# Altium schematic sheet 12V_Supply.SchDoc
size Tabloid; Organization: Altium Limited; Address1: L3, 12a Rodborough Rd; Address2: Frenchs Forest; Address3: NSW; Address4: Australia 2086
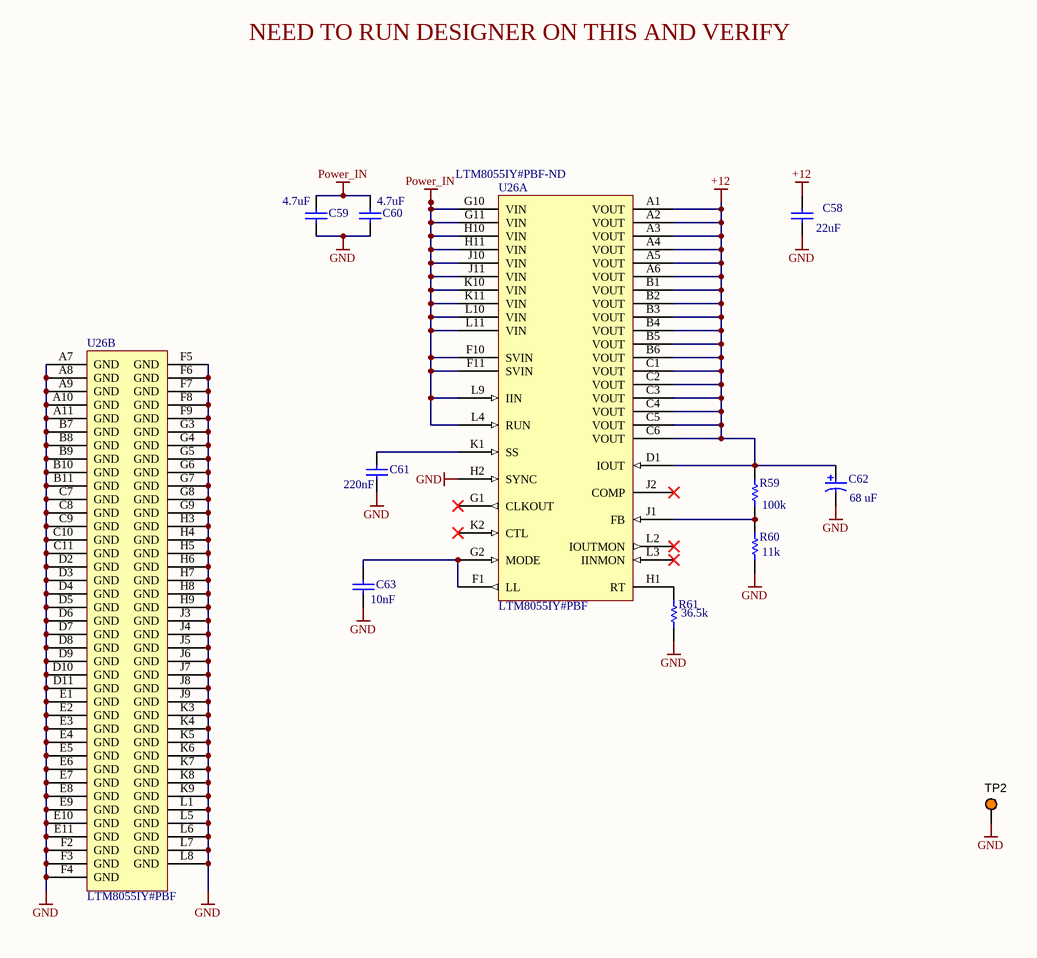
[diagram p0: 12V_Supply.SchDoc]

## Parts
C58  Capacitance: 22uF  [CAPC0805(2012)155_L]  (hidden comment: CAP CER 1UF 25V X7R 0805)
C59  Capacitance: 4.7uF  [CAPC3225X280X50LL20T25]  (hidden comment: C1210C475K5RACTU)
C60  Capacitance: 4.7uF  [CAPC3225X280X50LL20T25]  (hidden comment: C1210C475K5RACTU)
C61  Capacitance: 220nF  [CAPC0402(1005)60_M]  (hidden comment: GRM155R71C224KA12D)
C62  Rated Capacitance: 68 uF  [NIC-CAPA2-6.3X5.8_V]  (hidden comment: UUD1E680MCL1GS)
C63  Capacitance: 10nF  [CAPC1005X56X25NL10T15]  (hidden comment: 0402YC103KAT2A)
R59  Resistance: 100k  [RESC1609X50X30LL10T20]  (hidden comment: CRCW0603100KFKEA)
R60  Resistance: 11k  [RESC1609X50X30ML10T20]  (hidden comment: CRCW060311K0FKEA)
R61  Resistance: 36.5k  [RESC0805(2012)_L]  (hidden comment: CRCW080536K5FKEA)
TP2  5003  [KSTN-5003]  (value not drawn)
U26  LTM8055IY#PBF  Supplier Part Number 1: LTM8055IY#PBF-ND  [LT-BGA-121-15000X15000X4920]  (parts A,B of 2)

## Nets
+12: C58.2 C62.1 R59.2 U26.A1(VOUT) U26.A2(VOUT) U26.A3(VOUT) U26.A4(VOUT) U26.A5(VOUT) U26.A6(VOUT) U26.B1(VOUT) U26.B2(VOUT) U26.B3(VOUT) U26.B4(VOUT) U26.B5(VOUT) U26.B6(VOUT) U26.C1(VOUT) U26.C2(VOUT) U26.C3(VOUT) U26.C4(VOUT) U26.C5(VOUT) U26.C6(VOUT) U26.D1(IOUT)
GND: C58.1 C59.1 C60.1 C61.1 C62.2 C63.1 R60.1 R61.1 TP2.1 U26.A7(GND) U26.A8(GND) U26.A9(GND) U26.A10(GND) U26.A11(GND) U26.B7(GND) U26.B8(GND) U26.B9(GND) U26.B10(GND) U26.B11(GND) U26.C7(GND) U26.C8(GND) U26.C9(GND) U26.C10(GND) U26.C11(GND) U26.D2(GND) U26.D3(GND) U26.D4(GND) U26.D5(GND) U26.D6(GND) U26.D7(GND) U26.D8(GND) U26.D9(GND) U26.D10(GND) U26.D11(GND) U26.E1(GND) U26.E2(GND) U26.E3(GND) U26.E4(GND) U26.E5(GND) U26.E6(GND) U26.E7(GND) U26.E8(GND) U26.E9(GND) U26.E10(GND) U26.E11(GND) U26.F2(GND) U26.F3(GND) U26.F4(GND) U26.F5(GND) U26.F6(GND) U26.F7(GND) U26.F8(GND) U26.F9(GND) U26.G3(GND) U26.G4(GND) U26.G5(GND) U26.G6(GND) U26.G7(GND) U26.G8(GND) U26.G9(GND) U26.H2(SYNC) U26.H3(GND) U26.H4(GND) U26.H5(GND) U26.H6(GND) U26.H7(GND) U26.H8(GND) U26.H9(GND) U26.J3(GND) U26.J4(GND) U26.J5(GND) U26.J6(GND) U26.J7(GND) U26.J8(GND) U26.J9(GND) U26.K3(GND) U26.K4(GND) U26.K5(GND) U26.K6(GND) U26.K7(GND) U26.K8(GND) U26.K9(GND) U26.L1(GND) U26.L5(GND) U26.L6(GND) U26.L7(GND) U26.L8(GND)
Power_IN: C59.2 C60.2 U26.F10(SVIN) U26.F11(SVIN) U26.G10(VIN) U26.G11(VIN) U26.H10(VIN) U26.H11(VIN) U26.J10(VIN) U26.J11(VIN) U26.K10(VIN) U26.K11(VIN) U26.L4(RUN) U26.L9(IIN) U26.L10(VIN) U26.L11(VIN)
NetC61_2: C61.2 U26.K1(SS)
NetC63_2: C63.2 U26.F1(LL) U26.G2(MODE)
NetR59_1: R59.1 R60.2 U26.J1(FB)
NetR61_2: R61.2 U26.H1(RT)

Not connected (* = marked no-connect by the designer): U26 G1(CLKOUT)* J2(COMP)* K2(CTL)* L2(IOUTMON)* L3(IINMON)*

## Notes on the sheet
- NEED TO RUN DESIGNER ON THIS AND VERIFY
- Title
- Size:
- Date:
- Tabloid
- Number:
- Time:
- Revision:
- Sheet
- of
- File:

## Library data of the parts
C58 = CMP-1036-04882-1: 22uF 25V X7R 20% 0805; Manufacturer: Kyocera AVX; Manufacturer Part Number: 08053C105JAT2A; Tolerance: 5%; Supplier 1: Digi-Key; Supplier Part Number 1: 478-10487-1-ND; Stock 1: 13733; Pricing 1: 1=0.44000, 10=0.30400, 100=0.18220, 500=0.13662, 1000=0.11537 (USD); RoHS: Yes; Mount: Surface Mount; Case/Package: 0805; Number of Pins: 2; Case Code (Metric): 2012; Case Code (Imperial): 0805; Contact Plating: Tin; Min Operating Temperature: -55°C; Max Operating Temperature: 125°C; Packaging: Tape and Reel; Voltage Rating: 25V; Package Quantity: 2000; Dielectric: X7R; Voltage Rating (DC): 25V; Termination: SMD/SMT; Length: 2.01mm; Height: 1.4mm; Width: 0.049inch; Thickness: 0.037inch; Depth: 1.25mm; Radiation Hardening: No; REACH SVHC: Unknown; Lead Free: Lead Free; ComponentLink1URL: https://datasheet.ciiva.com/221/cx7r-221690.pdf?src-supplier=Digi-Key; ComponentLink1Description: https://datasheet.ciiva.com/221/cx7r-221690.pdf?src-supplier=Digi-Key; ComponentLink2URL: https://datasheet.ciiva.com/5419/cx7r-218113-5419770.pdf?src-supplier=Mouser; ComponentLink2Description: https://datasheet.ciiva.com/5419/cx7r-218113-5419770.pdf?src-supplier=Mouser; ComponentLink3URL: https://datasheet.ciiva.com/28586/1679506-28586091.pdf?src-supplier=Element14; ComponentLink3Description: https://datasheet.ciiva.com/28586/1679506-28586091.pdf?src-supplier=Element14; ComponentLink4URL: https://datasheet.ciiva.com/11499/cx7r-11499836.pdf?src-supplier=Avnet; ComponentLink4Description: https://datasheet.ciiva.com/11499/cx7r-11499836.pdf?src-supplier=Avnet
C59 C60 = CMP-2000-07550-1: Chip Capacitor, 4.7 uF, +/- 10%, 50 V, -55 to 125 degC, 1210 (3225 Metric), RoHS, Tape and Reel; Manufacturer: Kemet; Voltage Rating (DC): 50V; Dielectric Material: Ceramic; Dielectric: X7R; Case\/Package: 1210; Height: 0.098inch; Datasheet URL: https://search.kemet.com/component-edge/download/datasheet/C1210C475K5RACTU.pdf; Voltage: 50V; Packaging: TapeandReel; Package Reference: 1210; Mounting Technology: SurfaceMount; Package Description: 2-Pin Surface Mount Device, Body 3.2 x 2.5 mm; Manufacturer URL: http://www.kemet.com/; Width: 0.098inch; Voltage Rating: 50V; Package Quantity: 1000; Thickness: 0.11inch; Number of Pins: 2; Case Code (Imperial): 1210; Termination: SMD/SMT; Radiation Hardening: No; Depth: 2.5mm; RoHSCompliant: True; Datasheet Version: 06/2017; Length: 3.2mm; REACH SVHC: NoSVHC; Max Operating Temperature: 125degC; Min Operating Temperature: -55degC; Case Code (Metric): 3225; Mount: SurfaceMount; Tolerance: 10%; Supplier 1: Digi-Key; Supplier Part Number 1: 399-6785-1-ND
C61 = CMP-1034-02089-1: 0.22µF ±10% 16V Ceramic Capacitor X7R 0402 (1005 Metric); Manufacturer: Murata; Value: 220nF; Case-Metric: 1005; Case-EIA: 0402; Tolerance: Â±10%; Technology: SMT; Max Thickness: 0.6 mm; Rated Voltage: 16 V; Supplier 1: Digi-Key; Supplier Part Number 1: 490-5418-1-ND; Manufacturer Part Number: GRM155R71C224KA12D; Stock 1: 353724; Pricing 1: 1=0.14000, 10=0.10100, 100=0.04750, 500=0.03334, 1000=0.02760, 2500=0.02568, 5000=0.02350 (USD); RoHS: Yes; Mount: Surface Mount; Case/Package: 0402; Case Code (Metric): 1005; Case Code (Imperial): 0402; Material: Ceramic; Min Operating Temperature: -55°C; Max Operating Temperature: 125°C; Voltage Rating: 16V; Packaging: Tape and Reel; Package Quantity: 1; Voltage Rating (DC): 16V; Dielectric: X7R; Termination: SMD/SMT; Voltage: 16V; Length: 1mm; Height: 0.5mm; Width: 0.02inch; Thickness: 0.022inch; Depth: 0.5mm; Radiation Hardening: No; Lead Free: Lead Free; REACH SVHC: No SVHC; ComponentLink1URL: https://datasheet.ciiva.com/18184/getdatasheetpartid-347270-18184668.pdf?src-supplier=Verical; ComponentLink1Description: https://datasheet.ciiva.com/18184/getdatasheetpartid-347270-18184668.pdf?src-supplier=Verical; ComponentLink2URL: https://datasheet.ciiva.com/132/product-132672.pdf?src-supplier=Digi-Key; ComponentLink2Description: https://datasheet.ciiva.com/132/product-132672.pdf?src-supplier=Digi-Key; ComponentLink3URL: https://datasheet.ciiva.com/29199/454127-da-01-en-vs-kondensator-0402-29199807.pdf?src-supplier=Conrad; ComponentLink3Description: https://datasheet.ciiva.com/29199/454127-da-01-en-vs-kondensator-0402-29199807.pdf?src-supplier=Conrad; ComponentLink4URL: https://datasheet.ciiva.com/16467/product-16467307.pdf?src-supplier=Future+Electronics; ComponentLink4Description: https://datasheet.ciiva.com/16467/product-16467307.pdf?src-supplier=Future+Electronics; ComponentLink5URL: https://datasheet.ciiva.com/48671/product-48671325.pdf?src-supplier=Avnet; ComponentLink5Description: https://datasheet.ciiva.com/48671/product-48671325.pdf?src-supplier=Avnet; ComponentLink6URL: https://datasheet.ciiva.com/132/partnumbering-e-01-132670.pdf?src-supplier=Digi-Key; ComponentLink6Description: https://datasheet.ciiva.com/132/partnumbering-e-01-132670.pdf?src-supplier=Digi-Key; ComponentLink7URL: https://datasheet.ciiva.com/132/partnumbering-e-01-132671.pdf?src-supplier=Digi-Key; ComponentLink7Description: https://datasheet.ciiva.com/132/partnumbering-e-01-132671.pdf?src-supplier=Digi-Key
C62 = CMP-0687-00036-1: Aluminum Electrolytic Capacitor, UD Series, Low Impedance, 68 uF, 25 V, + / - 20%, -55 to 105 degC, Chip Type, 6.3 x 5.8 mm D x L, Pb-Free, Reel; Manufacturer: Nichicon; Packing: Dia382mm Reel; Rated Voltage: 25 V; Impedance: 0.44 Ohm; Rated Ripple Current (at 100kHz): 230 mA; Endurance Time: 2000 h; Tolerance Rated Capacitance: -20 to 20%; ComponentLink3Description: Package Specification; ComponentLink2Description: Datasheet; Diameter: 6.3 mm; PackageReference: CAPAE-D6.3H5.8; Length: 5.8 mm; ComponentLink3URL: http://products.nichicon.co.jp/en/pdf/XJA043/e-ud.pdf; Mounting Technology: Surface Mount; DatasheetVersion: 08/2012; PackageDescription: 2-Pin Surface Mount Device, Diameter 6.3 mm, Height 5.8 mm, Pitch 5.4 mm; ComponentLink2URL: http://products.nichicon.co.jp/en/pdf/XJA043/e-ud.pdf; PartNumber: UUD1E680MCL1GS; ComponentLink1Description: Manufacturer URL; ComponentLink1URL: http://www.nichicon.co.jp/; RoHS: TRUE; Supplier 1: Digi-Key; Supplier Part Number 1: 493-2275-1-ND
C63 = CMP-2008-02797-1: 10000pF ±10% 16V Ceramic Capacitor X7R 0402 (1005 Metric); Manufacturer: AVX Interconnect / Elco; Insulation Resistance: 100GR; Part Number: 0402YC103KAT2A; Supplier 1: Digi-Key; Supplier Part Number 1: 478-1114-1-ND; Manufacturer Part Number: 0402YC103KAT2A; Stock 1: 3382324; Pricing 1: 1=0.10000, 10=0.03800, 100=0.01690, 500=0.01210, 1000=0.00950, 2500=0.00864, 5000=0.00795 (USD); RoHS: Yes; Mount: Surface Mount; Case/Package: 0402; Case Code (Imperial): 0402; Case Code (Metric): 1005; Contact Plating: Tin; Min Operating Temperature: -55°C; Max Operating Temperature: 125°C; Tolerance: 10%; Voltage Rating: 16V; Voltage Rating (DC): 16V; Packaging: Tape and Reel; Dielectric: X7R; Package Quantity: 1; Termination: SMD/SMT; Voltage: 16V; Length: 1mm; Height: 0.5mm; Width: 0.5mm; Thickness: 0.022inch; Depth: 0.5mm; Radiation Hardening: No; REACH SVHC: No SVHC; Lead Free: Lead Free; ComponentLink1URL: https://datasheet.ciiva.com/11788/0900766b80dc2409-11788541.pdf?src-supplier=RSComponents; ComponentLink1Description: https://datasheet.ciiva.com/11788/0900766b80dc2409-11788541.pdf?src-supplier=RSComponents; ComponentLink2URL: https://datasheet.ciiva.com/1123/319609-1123954.pdf?src-supplier=Element14; ComponentLink2Description: https://datasheet.ciiva.com/1123/319609-1123954.pdf?src-supplier=Element14; ComponentLink3URL: https://datasheet.ciiva.com/1123/319609-1123955.pdf?src-supplier=Element14; ComponentLink3Description: https://datasheet.ciiva.com/1123/319609-1123955.pdf?src-supplier=Element14; ComponentLink4URL: https://datasheet.ciiva.com/14596/70001075-14596855.pdf?src-supplier=Allied+Electronics; ComponentLink4Description: https://datasheet.ciiva.com/14596/70001075-14596855.pdf?src-supplier=Allied+Electronics; ComponentLink5URL: https://datasheet.ciiva.com/2987/cx7r-2987704.pdf?src-supplier=Avnet; ComponentLink5Description: https://datasheet.ciiva.com/2987/cx7r-2987704.pdf?src-supplier=Avnet; ComponentLink6URL: https://datasheet.ciiva.com/22749/683218-22749625.pdf?src-supplier=Element14; ComponentLink6Description: https://datasheet.ciiva.com/22749/683218-22749625.pdf?src-supplier=Element14; ComponentLink7URL: https://datasheet.ciiva.com/16290/cx7r-16290154.pdf?src-supplier=Future+Electronics; ComponentLink7Description: https://datasheet.ciiva.com/16290/cx7r-16290154.pdf?src-supplier=Future+Electronics; ComponentLink8URL: https://datasheet.ciiva.com/7709/683218-7709771.pdf?src-supplier=Element14; ComponentLink8Description: https://datasheet.ciiva.com/7709/683218-7709771.pdf?src-supplier=Element14; ComponentLink9URL: https://datasheet.ciiva.com/15212/getdatasheetpartid-110062-15212107.pdf?src-supplier=Verical; ComponentLink9Description: https://datasheet.ciiva.com/15212/getdatasheetpartid-110062-15212107.pdf?src-supplier=Verical; ComponentLink10URL: https://datasheet.ciiva.com/5417/cx7r-218113-5417068.pdf?src-supplier=Mouser; ComponentLink10Description: https://datasheet.ciiva.com/5417/cx7r-218113-5417068.pdf?src-supplier=Mouser; ComponentLink11URL: https://datasheet.ciiva.com/150/cx7r-150221.pdf?src-supplier=Digi-Key; ComponentLink11Description: https://datasheet.ciiva.com/150/cx7r-150221.pdf?src-supplier=Digi-Key; ComponentLink12URL: https://datasheet.ciiva.com/150/cx7r-150222.pdf?src-supplier=Digi-Key; ComponentLink12Description: https://datasheet.ciiva.com/150/cx7r-150222.pdf?src-supplier=Digi-Key; ComponentLink13URL: https://datasheet.ciiva.com/150/cx7r-150223.pdf?src-supplier=Digi-Key; ComponentLink13Description: https://datasheet.ciiva.com/150/cx7r-150223.pdf?src-supplier=Digi-Key
R59 = CMP-2000-03820-1: 100 kOhms ±1% 0.1W, 1/10W Chip Resistor 0603 (1608 Metric) Automotive AEC-Q200 Thick Film; Manufacturer: Vishay Dale; Manufacturer Part Number: CRCW0603-100KFKEA; Power Rating: 100mW; Temperature Coefficient: 100ppm/°C; Voltage Rating: 75V; Part Number: CRCW0603100KFKEA; Supplier 1: Newark; Supplier Part Number 1: 95AC8750; Stock 1: 0; RoHS: Yes; Case/Package: 0603; Number of Pins: 2; Weight: 7.1E-05oz; Case Code (Metric): 1608; Case Code (Imperial): 0603; Contact Plating: Tin; Min Operating Temperature: -55°C; Max Operating Temperature: 155°C; Packaging: Tape and Reel; Tolerance: 1%; Composition: Thick Film; Termination: SMD/SMT; Voltage Rating (DC): 75V; Number of Terminations: 2; Max Power Dissipation: 100mW; Package Quantity: 10; Military Standard: Not; Features: Automotive AEC-Q200; Length: 1.55mm; Height: 0.45mm; Width: 0.033inch; Depth: 0.85mm; Radiation Hardening: No; Lead Free: Lead Free; REACH SVHC: Unknown; ComponentLink1URL: https://datasheet.ciiva.com/11809/0900766b80d98afc-11809004.pdf?src-supplier=RSComponents; ComponentLink1Description: https://datasheet.ciiva.com/11809/0900766b80d98afc-11809004.pdf?src-supplier=RSComponents; ComponentLink2URL: https://datasheet.ciiva.com/2465/dcrcwe3-2465525.pdf?src-supplier=Digi-Key; ComponentLink2Description: https://datasheet.ciiva.com/2465/dcrcwe3-2465525.pdf?src-supplier=Digi-Key; ComponentLink3URL: https://datasheet.ciiva.com/7777/1697337-7777269.pdf?src-supplier=Element14; ComponentLink3Description: https://datasheet.ciiva.com/7777/1697337-7777269.pdf?src-supplier=Element14; ComponentLink4URL: https://datasheet.ciiva.com/15159/getdatasheetpartid-93113-15159925.pdf?src-supplier=Verical; ComponentLink4Description: https://datasheet.ciiva.com/15159/getdatasheetpartid-93113-15159925.pdf?src-supplier=Verical; ComponentLink5URL: https://datasheet.ciiva.com/46441/1720486-46441605.pdf?src-supplier=Element14; ComponentLink5Description: https://datasheet.ciiva.com/46441/1720486-46441605.pdf?src-supplier=Element14; ComponentLink6URL: https://datasheet.ciiva.com/2465/dcrcwe3-2465526.pdf?src-supplier=Digi-Key; ComponentLink6Description: https://datasheet.ciiva.com/2465/dcrcwe3-2465526.pdf?src-supplier=Digi-Key; ComponentLink7URL: https://datasheet.ciiva.com/2465/dcrcwe3-2465527.pdf?src-supplier=Digi-Key; ComponentLink7Description: https://datasheet.ciiva.com/2465/dcrcwe3-2465527.pdf?src-supplier=Digi-Key; ComponentLink8URL: https://datasheet.ciiva.com/8340/dcrcwe3-8340199.pdf?src-supplier=Avnet; ComponentLink8Description: https://datasheet.ciiva.com/8340/dcrcwe3-8340199.pdf?src-supplier=Avnet; ComponentLink9URL: https://datasheet.ciiva.com/16725/70201119-16725223.pdf?src-supplier=Allied+Electronics; ComponentLink9Description: https://datasheet.ciiva.com/16725/70201119-16725223.pdf?src-supplier=Allied+Electronics; ComponentLink10URL: https://datasheet.ciiva.com/8340/dcrcwe3-8340201.pdf?src-supplier=Avnet; ComponentLink10Description: https://datasheet.ciiva.com/8340/dcrcwe3-8340201.pdf?src-supplier=Avnet; ComponentLink11URL: https://datasheet.ciiva.com/7791/66915-7791994.pdf?src-supplier=Element14; ComponentLink11Description: https://datasheet.ciiva.com/7791/66915-7791994.pdf?src-supplier=Element14; ComponentLink12URL: https://datasheet.ciiva.com/5545/dcrcwe3-109170-5545100.pdf?src-supplier=Mouser; ComponentLink12Description: https://datasheet.ciiva.com/5545/dcrcwe3-109170-5545100.pdf?src-supplier=Mouser; ComponentLink13URL: https://datasheet.ciiva.com/26317/fld-crcw-e3-data-en-26317165.pdf?src-supplier=Distrelec; ComponentLink13Description: https://datasheet.ciiva.com/26317/fld-crcw-e3-data-en-26317165.pdf?src-supplier=Distrelec; ComponentLink14URL: https://datasheet.ciiva.com/16941/dcrcw-16941311.pdf?src-supplier=Avnet+Europe; ComponentLink14Description: https://datasheet.ciiva.com/16941/dcrcw-16941311.pdf?src-supplier=Avnet+Europe
R60 = CMP-2000-03860-1: 11 kOhms ±1% 0.1W, 1/10W Chip Resistor 0603 (1608 Metric) Automotive AEC-Q200 Thick Film; Manufacturer: Vishay Dale; Temperature Coefficient: 100ppm/°C; Max Power Dissipation: 100mW; Voltage Rating (DC): 75V; Part Number: CRCW060311K0FKEA; Supplier 1: Digi-Key; Supplier Part Number 1: 541-11.0KHCT-ND; Manufacturer Part Number: CRCW060311K0FKEA; Stock 1: 29614; Pricing 1: 1=0.10000, 10=0.03600, 100=0.01460, 1000=0.00654, 2500=0.00568 (USD); RoHS: Yes; Mount: Surface Mount; Case/Package: 0603; Number of Pins: 2; Weight: 7.1E-05oz; Case Code (Metric): 1608; Case Code (Imperial): 0603; Contact Plating: Tin; Min Operating Temperature: -55°C; Max Operating Temperature: 155°C; Tolerance: 1%; Packaging: Tape and Reel; Composition: Thick Film; Number of Terminations: 2; Package Quantity: 10; Power Rating: 100mW; Voltage Rating: 75V; Features: Automotive AEC-Q200; Termination: SMD/SMT; Military Standard: Not; Length: 1.55mm; Height: 0.45mm; Width: 0.033inch; Depth: 0.85mm; Radiation Hardening: No; Lead Free: Lead Free; REACH SVHC: Unknown; ComponentLink1URL: https://datasheet.ciiva.com/11809/0900766b80d98afc-11809007.pdf?src-supplier=RSComponents; ComponentLink1Description: https://datasheet.ciiva.com/11809/0900766b80d98afc-11809007.pdf?src-supplier=RSComponents; ComponentLink2URL: https://datasheet.ciiva.com/2466/dcrcwe3-2466048.pdf?src-supplier=Digi-Key; ComponentLink2Description: https://datasheet.ciiva.com/2466/dcrcwe3-2466048.pdf?src-supplier=Digi-Key; ComponentLink3URL: https://datasheet.ciiva.com/7172/1635184-7172998.pdf?src-supplier=Newark; ComponentLink3Description: https://datasheet.ciiva.com/7172/1635184-7172998.pdf?src-supplier=Newark; ComponentLink4URL: https://datasheet.ciiva.com/15159/getdatasheetpartid-67722-15159671.pdf?src-supplier=Verical; ComponentLink4Description: https://datasheet.ciiva.com/15159/getdatasheetpartid-67722-15159671.pdf?src-supplier=Verical; ComponentLink5URL: https://datasheet.ciiva.com/16785/70201119-16785768.pdf?src-supplier=Allied+Electronics; ComponentLink5Description: https://datasheet.ciiva.com/16785/70201119-16785768.pdf?src-supplier=Allied+Electronics; ComponentLink6URL: https://datasheet.ciiva.com/22704/1697337-22704604.pdf?src-supplier=Element14; ComponentLink6Description: https://datasheet.ciiva.com/22704/1697337-22704604.pdf?src-supplier=Element14; ComponentLink7URL: https://datasheet.ciiva.com/7663/1697337-7663869.pdf?src-supplier=Element14; ComponentLink7Description: https://datasheet.ciiva.com/7663/1697337-7663869.pdf?src-supplier=Element14; ComponentLink8URL: https://datasheet.ciiva.com/16758/70201119-16758861.pdf?src-supplier=Allied+Electronics; ComponentLink8Description: https://datasheet.ciiva.com/16758/70201119-16758861.pdf?src-supplier=Allied+Electronics; ComponentLink9URL: https://datasheet.ciiva.com/16885/dcrcwe3-16885213.pdf?src-supplier=Avnet+Europe; ComponentLink9Description: https://datasheet.ciiva.com/16885/dcrcwe3-16885213.pdf?src-supplier=Avnet+Europe; ComponentLink10URL: https://datasheet.ciiva.com/16389/dcrcwe3-16389278.pdf?src-supplier=Future+Electronics; ComponentLink10Description: https://datasheet.ciiva.com/16389/dcrcwe3-16389278.pdf?src-supplier=Future+Electronics; ComponentLink11URL: https://datasheet.ciiva.com/26314/fld-crcw-e3-data-en-26314750.pdf?src-supplier=Distrelec; ComponentLink11Description: https://datasheet.ciiva.com/26314/fld-crcw-e3-data-en-26314750.pdf?src-supplier=Distrelec; ComponentLink12URL: https://datasheet.ciiva.com/2466/dcrcwe3-2466047.pdf?src-supplier=Digi-Key; ComponentLink12Description: https://datasheet.ciiva.com/2466/dcrcwe3-2466047.pdf?src-supplier=Digi-Key; ComponentLink13URL: https://datasheet.ciiva.com/2466/dcrcwe3-2466049.pdf?src-supplier=Digi-Key; ComponentLink13Description: https://datasheet.ciiva.com/2466/dcrcwe3-2466049.pdf?src-supplier=Digi-Key; ComponentLink14URL: https://datasheet.ciiva.com/7663/1697337-7663868.pdf?src-supplier=Element14; ComponentLink14Description: https://datasheet.ciiva.com/7663/1697337-7663868.pdf?src-supplier=Element14; ComponentLink15URL: https://datasheet.ciiva.com/3256/dcrcwe3-3256975.pdf?src-supplier=Avnet; ComponentLink15Description: https://datasheet.ciiva.com/3256/dcrcwe3-3256975.pdf?src-supplier=Avnet; ComponentLink16URL: https://datasheet.ciiva.com/22674/1700796-22674591.pdf?src-supplier=Element14; ComponentLink16Description: https://datasheet.ciiva.com/22674/1700796-22674591.pdf?src-supplier=Element14
R61 = CMP-1013-00686-1: 36.5 kOhms ±1% 0.125W, 1/8W Chip Resistor 0805 (2012 Metric) Automotive AEC-Q200 Thick Film; Manufacturer: Vishay; Value: 36500.00 Ohm; Case-EIA: 0805; Case-Metric: 2012; Temperature Coefficient: 100ppm/°C; Power Rating: 125mW; Voltage Rating: 150V; Power: 0.125 W; Tolerance: 1 %; Technology: SMT; Supplier 1: Digi-Key; Supplier Part Number 1: 541-36.5KCCT-ND; Manufacturer Part Number: CRCW080536K5FKEA; Stock 1: 48910; Pricing 1: 1=0.10000, 10=0.06600, 100=0.02670, 1000=0.01199, 2500=0.01041 (USD); RoHS: Yes; Case/Package: 0805; Number of Pins: 2; Weight: 0.000194oz; Case Code (Imperial): 0805; Case Code (Metric): 2012; Contact Plating: Tin; Min Operating Temperature: -55°C; Max Operating Temperature: 155°C; Composition: Thick Film; Packaging: Tape and Reel; Package Quantity: 10; Number of Terminations: 2; Termination: SMD/SMT; Max Power Dissipation: 125mW; Military Standard: Not; Features: Automotive AEC-Q200; Length: 2mm; Height: 0.45mm; Width: 1.25mm; Depth: 1.25mm; Radiation Hardening: No; REACH SVHC: Unknown; ComponentLink1URL: https://datasheet.ciiva.com/11810/0900766b80d98b26-11810705.pdf?src-supplier=RSComponents; ComponentLink1Description: https://datasheet.ciiva.com/11810/0900766b80d98b26-11810705.pdf?src-supplier=RSComponents; ComponentLink2URL: https://datasheet.ciiva.com/6158/1697337-6158553.pdf?src-supplier=Farnell; ComponentLink2Description: https://datasheet.ciiva.com/6158/1697337-6158553.pdf?src-supplier=Farnell; ComponentLink3URL: https://datasheet.ciiva.com/17180/dcrcwe3-17180207.pdf?src-supplier=Avnet+Europe; ComponentLink3Description: https://datasheet.ciiva.com/17180/dcrcwe3-17180207.pdf?src-supplier=Avnet+Europe; ComponentLink4URL: https://datasheet.ciiva.com/15159/getdatasheetpartid-32738-15159319.pdf?src-supplier=Verical; ComponentLink4Description: https://datasheet.ciiva.com/15159/getdatasheetpartid-32738-15159319.pdf?src-supplier=Verical; ComponentLink5URL: https://datasheet.ciiva.com/9013/dcrcwe3-9013306.pdf?src-supplier=Avnet; ComponentLink5Description: https://datasheet.ciiva.com/9013/dcrcwe3-9013306.pdf?src-supplier=Avnet; ComponentLink6URL: https://datasheet.ciiva.com/7671/1697337-7671692.pdf?src-supplier=Element14; ComponentLink6Description: https://datasheet.ciiva.com/7671/1697337-7671692.pdf?src-supplier=Element14; ComponentLink7URL: https://datasheet.ciiva.com/16781/70201119-16781068.pdf?src-supplier=Allied+Electronics; ComponentLink7Description: https://datasheet.ciiva.com/16781/70201119-16781068.pdf?src-supplier=Allied+Electronics; ComponentLink8URL: https://datasheet.ciiva.com/2514/dcrcwe3-2514301.pdf?src-supplier=Digi-Key; ComponentLink8Description: https://datasheet.ciiva.com/2514/dcrcwe3-2514301.pdf?src-supplier=Digi-Key; ComponentLink9URL: https://datasheet.ciiva.com/7671/1697337-7671693.pdf?src-supplier=Element14; ComponentLink9Description: https://datasheet.ciiva.com/7671/1697337-7671693.pdf?src-supplier=Element14; ComponentLink10URL: https://datasheet.ciiva.com/9013/dcrcwe3-9013309.pdf?src-supplier=Avnet; ComponentLink10Description: https://datasheet.ciiva.com/9013/dcrcwe3-9013309.pdf?src-supplier=Avnet; ComponentLink11URL: https://datasheet.ciiva.com/2514/dcrcwe3-2514302.pdf?src-supplier=Digi-Key; ComponentLink11Description: https://datasheet.ciiva.com/2514/dcrcwe3-2514302.pdf?src-supplier=Digi-Key; ComponentLink12URL: https://datasheet.ciiva.com/2514/dcrcwe3-2514303.pdf?src-supplier=Digi-Key; ComponentLink12Description: https://datasheet.ciiva.com/2514/dcrcwe3-2514303.pdf?src-supplier=Digi-Key
TP2 = CMP-1672-00009-1: Test Point, Orange, 1-Pin THD, RoHS; Peak Reverse Current: 600 uA; Forward Current: 3 A; Max Surge Current: 80 A; Forward Voltage: 1.08 V; Max Operating Temperature: 150 degC; PackageReference: 5003; Pins: 2; ComponentLink2URL: http://keyelco.com/userAssets/file/M65p56.pdf; PackageDescription: 1-Pin Through Hole Device, Dia 2.54 mm; Weight: 0.01 lb; Diameter: 5.3 mm; Mount: Through Hole; Package Quantity: 500; Packaging: Bulk; Min Operating Temperature: -65 degC; ComponentLink1Description: Manufacturer URL; Height: 0.25 inch; ComponentLink1URL: http://www.keyelco.com/; ComponentLink2Description: Datasheet; Width: 0.25 inch; REACH SVHC: No SVHC; RoHSCompliant: true; Radiation Hardening: No; Length: 9.5 mm; DatasheetVersion: Jun-15
U26 = CMP-2000-06615-1: Buck-Boost uModule Regulator, 8.5 A, 5 to 36 V, -40 to 125 degC, 121-Ball BGA, RoHS, Tray; Manufacturer: LinearTechnology; Efficiency: 97.5%; Current - Output (Max): 8.5A; Voltage - Output 1: 1.2~36V; Voltage - Input (Min): 5V; Number of Outputs: 1; Voltage - Input (Max): 36V; Package Version: Rev. A, 11/2012; Voltage - Output 2: -; Package Description: 121-Ball BGA, Body 15 x 15 mm, Pitch 1.27 mm; Package / Case: 121-BGA; Mounting Technology: SurfaceMount; Voltage - Isolation: -; Package URL: http://www.linear.com/docs/41075; Series: µModule®; Package Reference: BGA-121; Power (Watts) - Manufacture Series: -; Operating Temperature: -40°C~125°C; Power (Watts) - Max: -; Applications: ITE(Commercial); Manufacturer URL: http://www.linear.com/; Category: PowerSupplies-BoardMount; Family: DCDCConverters; Features: OTP; Packaging: Tray; Voltage - Output 3: -; Datasheet Version: Rev. A, 01/2016; Datasheet URL: http://cds.linear.com/docs/en/datasheet/8055fa.pdf; Mounting Type: SurfaceMount; Type: Non-IsolatedPoLModule; PartId: 1; Supplier 1: Digi-Key